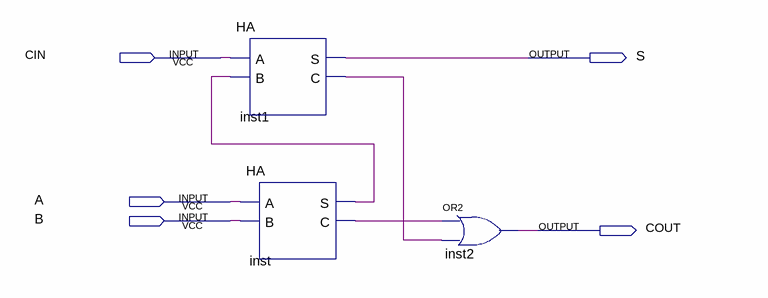
[diagram p0: schematic sheet]
// Quartus schematic HAFA.bdf as structural Verilog: 3 symbols, 5 pins
module HAFA (
  input  CIN,
  input  A,
  input  B,
  output S,
  output COUT
);

  wire inst1_c, inst_c, inst_s;

  HA inst1 (.A(CIN), .B(inst_s), .S(S), .C(inst1_c));
  HA inst (.A(A), .B(B), .S(inst_s), .C(inst_c));
  or inst2 (COUT, inst_c, inst1_c);
endmodule
